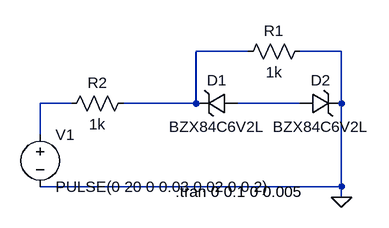
[diagram p0: schematic limitador_com_2_zeners.asc]
limitador_com_2_zeners.asc, the LTspice schematic file:
Version 4
SHEET 1 880 680
WIRE 16 32 -64 32
WIRE 160 32 96 32
WIRE -256 112 -304 112
WIRE -64 112 -64 32
WIRE -64 112 -176 112
WIRE 96 112 0 112
WIRE 160 112 160 32
WIRE -304 160 -304 112
WIRE 160 240 160 112
WIRE 160 240 -304 240
WIRE 160 256 160 240
FLAG 160 256 0
SYMBOL voltage -304 144 R0
WINDOW 123 0 0 Left 0
WINDOW 39 0 0 Left 0
SYMATTR InstName V1
SYMATTR Value PULSE(0 20 0 0.03 0.02 0 0 2)
SYMBOL zener 0 96 R90
WINDOW 0 -4 32 VBottom 2
WINDOW 3 36 32 VTop 2
SYMATTR InstName D1
SYMATTR Value BZX84C6V2L
SYMBOL zener 96 128 R270
WINDOW 0 36 32 VTop 2
WINDOW 3 -4 32 VBottom 2
SYMATTR InstName D2
SYMATTR Value BZX84C6V2L
SYMBOL res 112 16 R90
WINDOW 0 0 56 VBottom 2
WINDOW 3 32 56 VTop 2
SYMATTR InstName R1
SYMATTR Value 1k
SYMBOL res -160 96 R90
WINDOW 0 0 56 VBottom 2
WINDOW 3 32 56 VTop 2
SYMATTR InstName R2
SYMATTR Value 1k
TEXT -96 248 Left 2 !.tran 0 0.1 0 0.005

The netlist it stands for:
* limitador_com_2_zeners.asc
V1 N002 0 PULSE(0 20 0 0.03 0.02 0 0 2)
D1 N003 N001 BZX84C6V2L
D2 N003 0 BZX84C6V2L
R1 0 N001 1k
R2 N001 N002 1k
.model D D
.lib standard.dio
.tran 0 0.1 0 0.005
.backanno
.end